# Altium project QUT_Autopilot_Pixracer.PrjPcb (part 1 of 2)
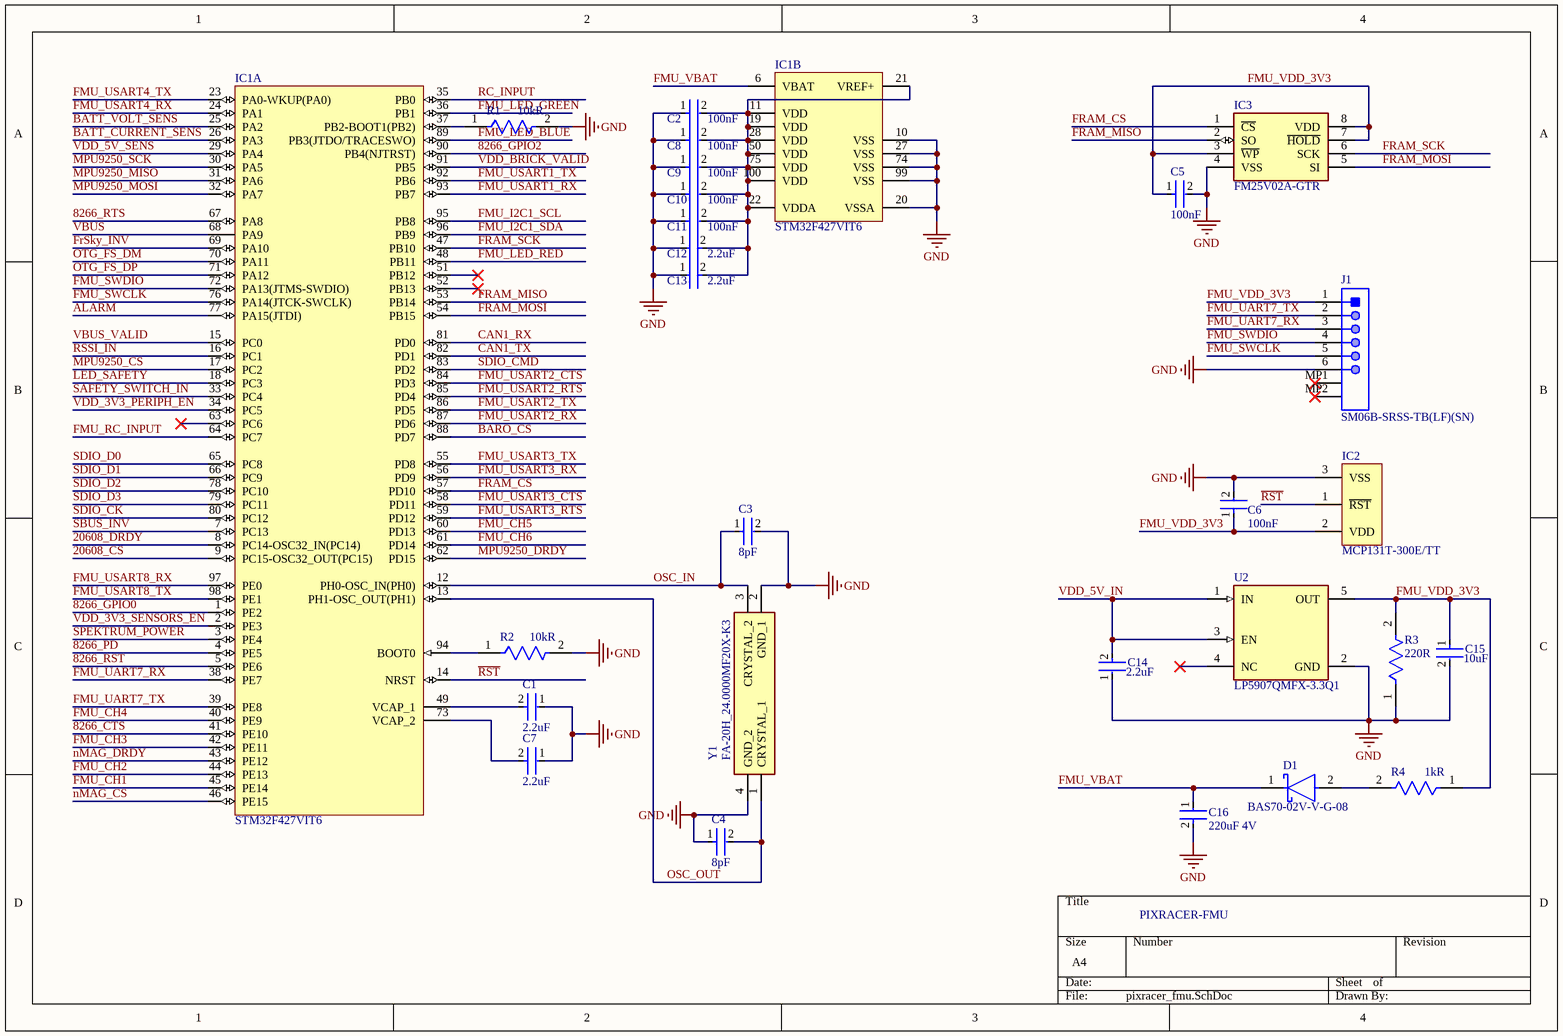
[diagram p0: pixracer_fmu.SchDoc]
5 sheets, 143 parts. Net scope: global (net labels, ports and power ports of the same name join across sheets).
Board file: pixracer_pcb_layout_v1.PcbDoc
Sheets:
  pixracer_fmu.SchDoc
  pixracer_imu.SchDoc
  pixracer_sd_usb_can_i2c.SchDoc
  pixracer_serials.SchDoc
  pixracer_power.SchDoc

## Sheet pixracer_fmu.SchDoc
size A4; SheetNumber: 1; SheetTotal: 5

### Parts
C1  Capacitance: 2.2uF  [FP-C1608-080-0_1-MFG]  (hidden comment: C1608X7R1A225K080AC)
C2  Capacitance: 100nF  [FP-0603-L_1_6_0_15-W_0_81-IPC_B]  (hidden comment: 0603ZC104MAT2A)
C3  Capacitance: 8pF  [FP-CGA3E-0_3-0_1-IPC_A]  (hidden comment: CGA3E2C0G1H080D080AA)
C4  Capacitance: 8pF  [FP-CGA3E-0_3-0_1-IPC_A]  (hidden comment: CGA3E2C0G1H080D080AA)
C5  Capacitance: 100nF  [FP-0603-L_1_6_0_15-W_0_81-IPC_B]  (hidden comment: 0603ZC104MAT2A)
C6  Capacitance: 100nF  [FP-0603-L_1_6_0_15-W_0_81-IPC_B]  (hidden comment: 0603ZC104MAT2A)
C7  Capacitance: 2.2uF  [FP-C1608-080-0_1-MFG]  (hidden comment: C1608X7R1A225K080AC)
C8  Capacitance: 100nF  [FP-0603-L_1_6_0_15-W_0_81-IPC_B]  (hidden comment: 0603ZC104MAT2A)
C9  Capacitance: 100nF  [FP-0603-L_1_6_0_15-W_0_81-IPC_B]  (hidden comment: 0603ZC104MAT2A)
C10  Capacitance: 100nF  [FP-0603-L_1_6_0_15-W_0_81-IPC_B]  (hidden comment: 0603ZC104MAT2A)
C11  Capacitance: 100nF  [FP-0603-L_1_6_0_15-W_0_81-IPC_B]  (hidden comment: 0603ZC104MAT2A)
C12  Capacitance: 2.2uF  [FP-C1608-080-0_1-MFG]  (hidden comment: C1608X7R1A225K080AC)
C13  Capacitance: 2.2uF  [FP-C1608-080-0_1-MFG]  (hidden comment: C1608X7R1A225K080AC)
C14  Capacitance: 2.2uF  [FP-C1608-080-0_1-MFG]  (hidden comment: C1608X7R1A225K080AC)
C15  Capacitance: 10uF  [FP-CL10-IPC_B]  (hidden comment: CL10A106KP8NNND)
C16  Capacitance: 220uF 4V  [FP-GRM31C-0_3-e0_3_0_9-IPC_C]  (hidden comment: GRM31CR60G227ME11L)
D1  BAS70-02V-V-G-08  [FP-S8-V-3880_02-001-MFG]
IC1  STM32F427VIT6  [STM-LQFP100_N]  (parts A,B of 2)
IC2  MCP131T-300E/TT  [SOT-23-TT3_N]
IC3  FM25V02A-GTR  [SOIC127P602X173-8N]
J1  SM06B-SRSS-TB(LF)(SN)  [JST-SM06B-SRSS-TB_V]
R1  Resistance: 10kR  [FP-ERJ3G-IPC_C]  (hidden comment: ERJ-3GEYJ103V)
R2  Resistance: 10kR  [FP-ERJ3G-IPC_C]  (hidden comment: ERJ-3GEYJ103V)
R3  Resistance: 220R  [FP-CRCW0603-e3-MFG]  (hidden comment: CRCW0603220RFKEB)
R4  Resistance: 1kR  [FP-RC1608-IPC_A]  (hidden comment: RC1608J102CS)
U2  LP5907QMFX-3.3Q1  [FP-DBV0005A-MFG]
Y1  FA-20H_24.0000MF20X-K3  [FA20H160000MF12ZAC3]

### Nets
GND: C1.1 C2.1 C3.2 C4.1 C5.2 C6.2 C7.1 C8.1 C9.1 C10.1 C11.1 C12.1 C13.1 C14.1 C15.2 C16.2 IC1.10(VSS) IC1.20(VSSA) IC1.27(VSS) IC1.74(VSS) IC1.99(VSS) IC2.3(VSS) IC3.4(VSS) J1.6 R1.2 R2.2 R3.1 U2.2(GND) Y1.2(GND_1) Y1.4(GND_2)
8266_CTS: IC1.41(PE10)
8266_GPIO0: IC1.1(PE2)
8266_GPIO2: IC1.90(PB4(NJTRST))
8266_PD: IC1.4(PE5)
8266_RST: IC1.5(PE6)
8266_RTS: IC1.67(PA8)
20608_CS: IC1.9(PC15-OSC32_OUT(PC15))
20608_DRDY: IC1.8(PC14-OSC32_IN(PC14))
~{RST}: IC1.14(NRST) IC2.1(~{RST})
ALARM: IC1.77(PA15(JTDI))
BARO_CS: IC1.88(PD7)
BATT_CURRENT_SENS: IC1.26(PA3)
BATT_VOLT_SENS: IC1.25(PA2)
CAN1_RX: IC1.81(PD0)
CAN1_TX: IC1.82(PD1)
FMU_CH1: IC1.45(PE14)
FMU_CH2: IC1.44(PE13)
FMU_CH3: IC1.42(PE11)
FMU_CH4: IC1.40(PE9)
FMU_CH5: IC1.60(PD13)
FMU_CH6: IC1.61(PD14)
FMU_I2C1_SCL: IC1.95(PB8)
FMU_I2C1_SDA: IC1.96(PB9)
FMU_LED_BLUE: IC1.89(PB3(JTDO/TRACESWO))
FMU_LED_GREEN: IC1.36(PB1)
FMU_LED_RED: IC1.48(PB11)
FMU_RC_INPUT: IC1.64(PC7)
FMU_SWCLK: IC1.76(PA14(JTCK-SWCLK)) J1.5
FMU_SWDIO: IC1.72(PA13(JTMS-SWDIO)) J1.4
FMU_UART7_RX: IC1.38(PE7) J1.3
FMU_UART7_TX: IC1.39(PE8) J1.2
FMU_USART1_RX: IC1.93(PB7)
FMU_USART1_TX: IC1.92(PB6)
FMU_USART2_CTS: IC1.84(PD3)
FMU_USART2_RTS: IC1.85(PD4)
FMU_USART2_RX: IC1.87(PD6)
FMU_USART2_TX: IC1.86(PD5)
FMU_USART3_CTS: IC1.58(PD11)
FMU_USART3_RTS: IC1.59(PD12)
FMU_USART3_RX: IC1.56(PD9)
FMU_USART3_TX: IC1.55(PD8)
FMU_USART4_RX: IC1.24(PA1)
FMU_USART4_TX: IC1.23(PA0-WKUP(PA0))
FMU_USART8_RX: IC1.97(PE0)
FMU_USART8_TX: IC1.98(PE1)
FMU_VBAT: C16.1 D1.1(C) IC1.6(VBAT)
FMU_VDD_3V3: C5.1 C6.1 C15.1 IC2.2(VDD) IC3.3(~{WP}) IC3.7(~{HOLD}) IC3.8(VDD) J1.1 R3.2 R4.1 U2.5(OUT)
FRAM_CS: IC1.57(PD10) IC3.1(~{CS})
FRAM_MISO: IC1.53(PB14) IC3.2(SO)
FRAM_MOSI: IC1.54(PB15) IC3.5(SI)
FRAM_SCK: IC1.47(PB10) IC3.6(SCK)
FrSky_INV: IC1.69(PA10)
LED_SAFETY: IC1.18(PC3)
MPU9250_CS: IC1.17(PC2)
MPU9250_DRDY: IC1.62(PD15)
MPU9250_MISO: IC1.31(PA6)
MPU9250_MOSI: IC1.32(PA7)
MPU9250_SCK: IC1.30(PA5)
nMAG_CS: IC1.46(PE15)
nMAG_DRDY: IC1.43(PE12)
OSC_IN: C3.1 IC1.12(PH0-OSC_IN(PH0)) Y1.3(CRYSTAL_2)
OSC_OUT: C4.2 IC1.13(PH1-OSC_OUT(PH1)) Y1.1(CRYSTAL_1)
OTG_FS_DM: IC1.70(PA11)
OTG_FS_DP: IC1.71(PA12)
RC_INPUT: IC1.35(PB0)
RSSI_IN: IC1.16(PC1)
SAFETY_SWITCH_IN: IC1.33(PC4)
SBUS_INV: IC1.7(PC13)
SDIO_CK: IC1.80(PC12)
SDIO_CMD: IC1.83(PD2)
SDIO_D0: IC1.65(PC8)
SDIO_D1: IC1.66(PC9)
SDIO_D2: IC1.78(PC10)
SDIO_D3: IC1.79(PC11)
SPEKTRUM_POWER: IC1.3(PE4)
VBUS: IC1.68(PA9)
VBUS_VALID: IC1.15(PC0)
VDD_3V3_PERIPH_EN: IC1.34(PC5)
VDD_3V3_SENSORS_EN: IC1.2(PE3)
VDD_5V_IN: C14.2 U2.1(IN) U2.3(EN)
VDD_5V_SENS: IC1.29(PA4)
VDD_BRICK_VALID: IC1.91(PB5)
NetC1_2: C1.2 IC1.49(VCAP_1)
NetC2_2: C2.2 C8.2 C9.2 C10.2 C11.2 C12.2 C13.2 IC1.11(VDD) IC1.19(VDD) IC1.21(VREF+) IC1.22(VDDA) IC1.28(VDD) IC1.50(VDD) IC1.75(VDD) IC1.100(VDD)
NetC7_2: C7.2 IC1.73(VCAP_2)
NetD1_2: D1.2(A) R4.2
NetIC1_37: IC1.37(PB2-BOOT1(PB2)) R1.1
NetIC1_94: IC1.94(BOOT0) R2.1

Not connected (* = marked no-connect by the designer): IC1 51(PB12)* 52(PB13)* 63(PC6)*; J1 MP1* MP2*; U2 4(NC)*

### Notes on the sheet
- PIXRACER-FMU

### Library data of the parts
C1 C7 C12-C14 = CMP-08246-006835-1: Multilayer Ceramic Capacitors 2.2μF ±10% 10V X7R SMD 0603; Lead Free: Lead Free; Mount: Surface Mount; Case Code (Metric): 1608; Construction: Flat; Packaging: Tape and Reel; REACH SVHC: No SVHC; Weight: 7.1E-05oz; Resistor Type: Ceramic; Package Quantity: 4000; Voltage Rating (DC): 10V; Case/Package: 0603; Termination: SMD/SMT; Case Code (Imperial): 0603; Series: C; Voltage Rating: 10V; Min Operating Temperature: -55°C; Dielectric Material: Ceramic; Length: 1.6mm; Tolerance: 10%; Depth: 0.8mm; Width: 0.031inch; Dielectric: X7R; Max Operating Temperature: 125°C; RoHS Compliant: Yes; Height: 0.8mm; Thickness: 0.037inch
C2 C5 C6 C8-C11 = CMP-2006-04550-2: General Purpose Ceramic Capacitor, 0603, 100nF, 20%, X7R, 15%, 10V; Mount: Surface Mount; Package Quantity: 4000; RoHS Compliant: Yes; Case Code (Imperial): 0603; Voltage Rating: 10V; Packaging: Tape and Reel; Series: -; Tolerance: 20%; Thickness: 0.035inch; Number of Pins: 2; Min Operating Temperature: -55°C; Case/Package: 0603; Length: 1.6mm; Radiation Hardening: No; Voltage Rating (DC): 10V; Depth: 0.81mm; Lead Pitch: 0.014inch; Termination: SMD/SMT; Case Code (Metric): 1608; Construction: Flat; Width: 0.032inch; Lead Free: Lead Free; Max Operating Temperature: 125°C; Dielectric: X7R
C3 C4 = CMP-08246-000516-1: Cap Ceramic 8pF 50V C0G 0.5pF Pad SMD 0603 +125°C Automotive T/R; Length: 1.6mm; Max Operating Temperature: 125°C; Voltage Rating: 50V; Depth: 0.8mm; Height: 0.8mm; Composition: Ceramic; Package Quantity: 4000; Thickness: 0.035inch; Packaging: Tape and Reel; Weight: 7.1E-05oz; Mount: Surface Mount; Ratings: AEC-Q200; Width: 0.031inch; Voltage Rating (DC): 50V; Termination: SMD/SMT; Case Code (Metric): 1608; Case Code (Imperial): 0603; Min Operating Temperature: -55°C; Dielectric: C0G; Case/Package: 0603; Radiation Hardening: No; REACH SVHC: No SVHC
C15 = CMP-13271-003245-1: Cap Ceramic 10uF 10V X5R ±10% Pad SMD 0603 +85°C T/R; Packaging: Tape and Reel; Dielectric: X5R; Min Operating Temperature: -55°C; Lead Free: Lead Free; Height: 0.8mm; Package Quantity: 10000; Voltage Rating (DC): 10V; Mount: Surface Mount; Tolerance: 10%; Width: 0.031inch; Thickness: 0.035inch; Depth: 0.8mm; Max Operating Temperature: 85°C; Case/Package: 0603; Length: 1.6mm; Voltage Rating: 10V; Radiation Hardening: No
C16 = CMP-06035-014715-1: Chip Multilayer Ceramic Capacitors for General Purpose, 1206, 220uF, X5R, 15%, 20%, 4V; Termination: SMD/SMT; Length: 0.126inch; Weight: 0.001411oz; Lead Free: Lead Free; Packaging: Tape and Reel; Voltage Rating: 4V; Dielectric: X5R; Voltage Rating (DC): 4V; Case Code (Metric): 3216; REACH SVHC: No SVHC; Mount: Surface Mount; Tolerance: 20%; Height: 1.6mm; Case Code (Imperial): 1206; Package Quantity: 2000; Width: 1.6mm; Thickness: 0.075inch; Case/Package: 1206; Max Operating Temperature: 85°C; Min Operating Temperature: -55°C
D1 = CMP-02539-000029-1: DIODE SCHOTTKY 70V 100MA SOD523; Manufacturer: Vishay; Peak Reverse Current: 0.02uA; Max Junction Temp: +125°C; Max Surge Forward Current: 600mA; Value: 1.5pF; Device Class L3: Schottky Diodes; Reverse Voltage: 70V; ComponentLink2URL: https://www.vishay.com/docs/82393/bas7002v.pdf; Device Class L2: Diodes; Max Repetitive Reverse Voltage: 70V; Forward Current: 100mA; Category: Diode; Temperature Range High: +125°C; Lead Free: Yes; ComponentLink2Description: Datasheet; Octopart: https://octopart.com/bas70-02v-v-g-08-vishay-44351226; Package: S8-V-3880.02-001; RoHS: TRUE; Mouser Description: Schottky Diodes & Rectifiers SCHOTTKY DIODE, PLASTIC; Ipc Land Pattern Name: SODFL16080X60; Capacitance: 1.5pF; Temperature: to +125°C; Device Class L1: Discrete Semiconductors; Height: 0.7mm; Manufacturer Part Number: BAS70-02V-V-G-08; Digikey Description: DIODE SCHOTTKY 70V 100MA SOD523; Automotive: No
IC1 = CMP-0243-00027-2: ARM Cortex-M4 32-bit MCU+FPU, 210 DMIPS, 2048 kB Flash, 256 kB Internal RAM, 82 I/Os, 100-pin LQFP, -40 to 85 degC, Tray; Manufacturer: STMicroelectronics; D/A Converter: 2x12-bit; FLASH Size (Prog) (kB): 2048; I/Os (High Current): 82; Internal RAM Size (kB): 256; Supply Voltage(Vcc) min (V): 1.8; Supply Voltage(Vcc) max (V): 3.6; Operating Frequency(F) (Processor speed) (MHz): 168; Core: ARM Cortex-M4; Mounting Technology: Surface Mount; ComponentLink1URL: http://www.st.com/web/en/home.html; ComponentLink3Description: Package Specification; DatasheetVersion: Rev. 1; ComponentLink3URL: http://www.st.com/st-web-ui/static/active/en/resource/technical/document/data_brief/DM00071938.pdf; ComponentLink2Description: Datasheet; PartNumber: STM32F427VIT6; PackageReference: LQFP100; PackageVersion: Rev. 1, 06/2013; ComponentLink1Description: Manufacturer URL; ComponentLink2URL: http://www.st.com/st-web-ui/static/active/en/resource/technical/document/datasheet/DM00071990.pdf; Packing: Tray; PackageDescription: 100-Pin Low Profile Quad Flat Package, 14 x 14 mm Body, 0.5 mm Pitch
IC2 = CMP-0138-00370-1: Micropower Voltage Supervisors, 3-Pin SOT-23, Extended Temperature, Tape and Reel; Code_IPC: SOT23-3; DatasheetVersion: revB, Mar-2005; PackageReference: SOT-23-TT3; PackageVersion: revBB, Aug-2009; PackageDescription: 3-Lead Plastic Small Outline Transistor (TT) [SOT-23]
IC3 = FM25V02A-GTR: Integrated Circuit; Manufacturer_Name: Cypress Semiconductor; Datasheet Link: https://www.cypress.com/file/139666/download; Height: 1.727mm; Manufacturer_Part_Number: FM25V02A-GTR; Mouser Part Number: 727-FM25V02A-GTR; Mouser Price/Stock: https://www.mouser.co.uk/ProductDetail/Cypress-Semiconductor/FM25V02A-GTR?qs=ILgNtqsyH21Sja70fv%2FiBQ%3D%3D; Arrow Part Number: FM25V02A-GTR; Arrow Price/Stock: https://www.arrow.com/en/products/fm25v02a-gtr/cypress-semiconductor?region=nac
J1 = CMP-2000-07080-1: Male Header, Pitch 1 mm, 1 x 6 Position, Height 2.95 mm, -25 to 85 degC, RoHS, Tape and Reel; Manufacturer: JST; No of Positions: 6; Pitch: 1mm; Style/Orientation: RightAngleHeader/Plug; Datasheet URL: https://datasheet.ciiva.com/26894/getdatasheetpartid-708885-26894671.pdf; Package Description: Male Header, Pitch 1 mm, 1 X 6 Position, Height 2.9 mm; Termination: Solder; Manufacturer URL: http://www.jst.com/home2.html; Type: ShroudedHeader; Package Reference: SM06B-SRSS-TB; Datasheet Version: 11/2010; Mounting Technology: SurfaceMount
R1 R2 = CMP-2000-00704-2: RES SMD 10K OHM 5% 1/10W 0603; Temperature Coefficient: 200ppm/°C; Max Power Dissipation: 100mW; Voltage Rating (DC): 50V; Voltage Rating: 75V; Resistor Type: Thick Film; Tolerance: 5%; Military Standard: Not; Package Quantity: 1; Max Operating Temperature: 155°C; Mount: Surface Mount; Technology: THICK FILM; Case/Package: 0603; Construction: Rectangular; Depth: 0.8mm; Case Code (Imperial): 0603; Weight: 7.1E-05oz; Features: Automotive AEC-Q200; Packaging: Tape and Reel; Width: 0.8mm; Length: 1.6mm; Termination: SMD/SMT; Power Rating: 100mW; Lead Free: Lead Free; Number of Terminations: 2; Height: 0.45mm; RoHS Compliant: Yes; Min Operating Temperature: -55°C; Contact Plating: Tin; REACH SVHC: No SVHC; Resistance Tolerance: 5%; Series: ERJ; Working Voltage: 75V; Case Code (Metric): 1608
R3 = CMP-02407-003555-1: RES Thick Film, 220Ω, 1%, 0.1W, 100ppm/°C, 0603; Voltage Rating: 75V; Power Rating: 100mW; Length: 1.55mm; Weight: 7.1E-05oz; Package Quantity: 10000; Case/Package: 0603; Composition: Thick Film; Max Operating Temperature: 155°C; Military Standard: Not; Tolerance: 1%; Lead Free: Lead Free; Number of Terminations: 2; Min Operating Temperature: -55°C; Case Code (Imperial): 0603; Max Power Dissipation: 100mW; Features: Automotive AEC-Q200; Packaging: Tape and Reel; Temperature Coefficient: 100ppm/°C; Case Code (Metric): 1608; Termination: SMD/SMT; Depth: 0.85mm; Height: 0.02inch; Width: 0.85mm
R4 = CMP-13261-002301-1: Res Thick Film 0603 1kΩ 5% 0.1W ±100ppm/°C Molded SMD T/R; Power Rating: 100mW; Voltage Rating (DC): 50V; Contact Plating: Tin; Mount: Surface Mount; Number of Terminations: 2; Features: Moisture Resistant; Max Power Dissipation: 100mW; Military Standard: Not; Case/Package: 0603; Radiation Hardening: No; Temperature Coefficient: 100ppm/°C; Length: 1.6mm; Height: 0.022inch; Case Code (Metric): 1608; Max Operating Temperature: 155°C; Composition: Thick Film; Tolerance: 5%; Width: 0.031inch; Depth: 0.8mm; Packaging: Tape and Reel; Lead Free: Lead Free; Case Code (Imperial): 0603; Min Operating Temperature: -55°C
U2 = CMP-04917-000018-1: IC REG LINEAR 3.3V 250MA SOT23-5; Manufacturer: Texas Instruments; Number Of Outputs: 1; Dropout Voltage: 120mV; Max Junction Temp: +125°C; Output Type: Fixed; Standoff Height: 0mm; Min Supply Voltage: 2.2V; Max Supply Voltage: 5.5V; Nominal Supply Current: 12-250uA; Automotive Grade: Grade 1; Output Voltage: 3.3V; Height: 1.45mm; Category: IC; Output Current: 250mA; Automotive: Yes; Device Class L3: Voltage Regulators - Linear; Temperature Range Low: -40°C; Device Class L1: Integrated Circuits (ICs); Temperature Range High: +125°C; Octopart: https://octopart.com/lp5907qmfx-3.3q1-texas+instruments-50417899; Lead Free: Yes; Device Class L2: Power Management ICs; Manufacturer Part Number: LP5907QMFX-3.3Q1; Mouser Description: Automotive 250-mA ultra-low-noise low-IQ low-dropout (LDO) linear regulator 5-SOT-23 -40 to 125; ComponentLink2Description: Datasheet; Digikey Description: IC REG LINEAR 3.3V 250MA SOT23-5; Temperature: -40°C to +125°C; Package: DBV0005A; ComponentLink2URL: http://www.ti.com/lit/ds/symlink/lp5907-q1.pdf; RoHS: TRUE
Y1 = FA-20H_24.0000MF20X-K3: Crystal or Oscillator; Manufacturer_Name: Epson Timing; Manufacturer_Part_Number: FA-20H 24.0000MF20X-K3; Datasheet Link: https://support.epson.biz/td/api/doc_check.php?dl=brief_FA-20H&lang=en; Height: 0.55mm; Mouser Part Number: 732-FA20H-24F20X-K3; Mouser Price/Stock: https://www.mouser.co.uk/ProductDetail/Epson-Timing/FA-20H-240000MF20X-K3?qs=CANAagUtPAp2w31393daZQ%3D%3D

## Sheet pixracer_imu.SchDoc
size A4; SheetNumber: 2; SheetTotal: 5
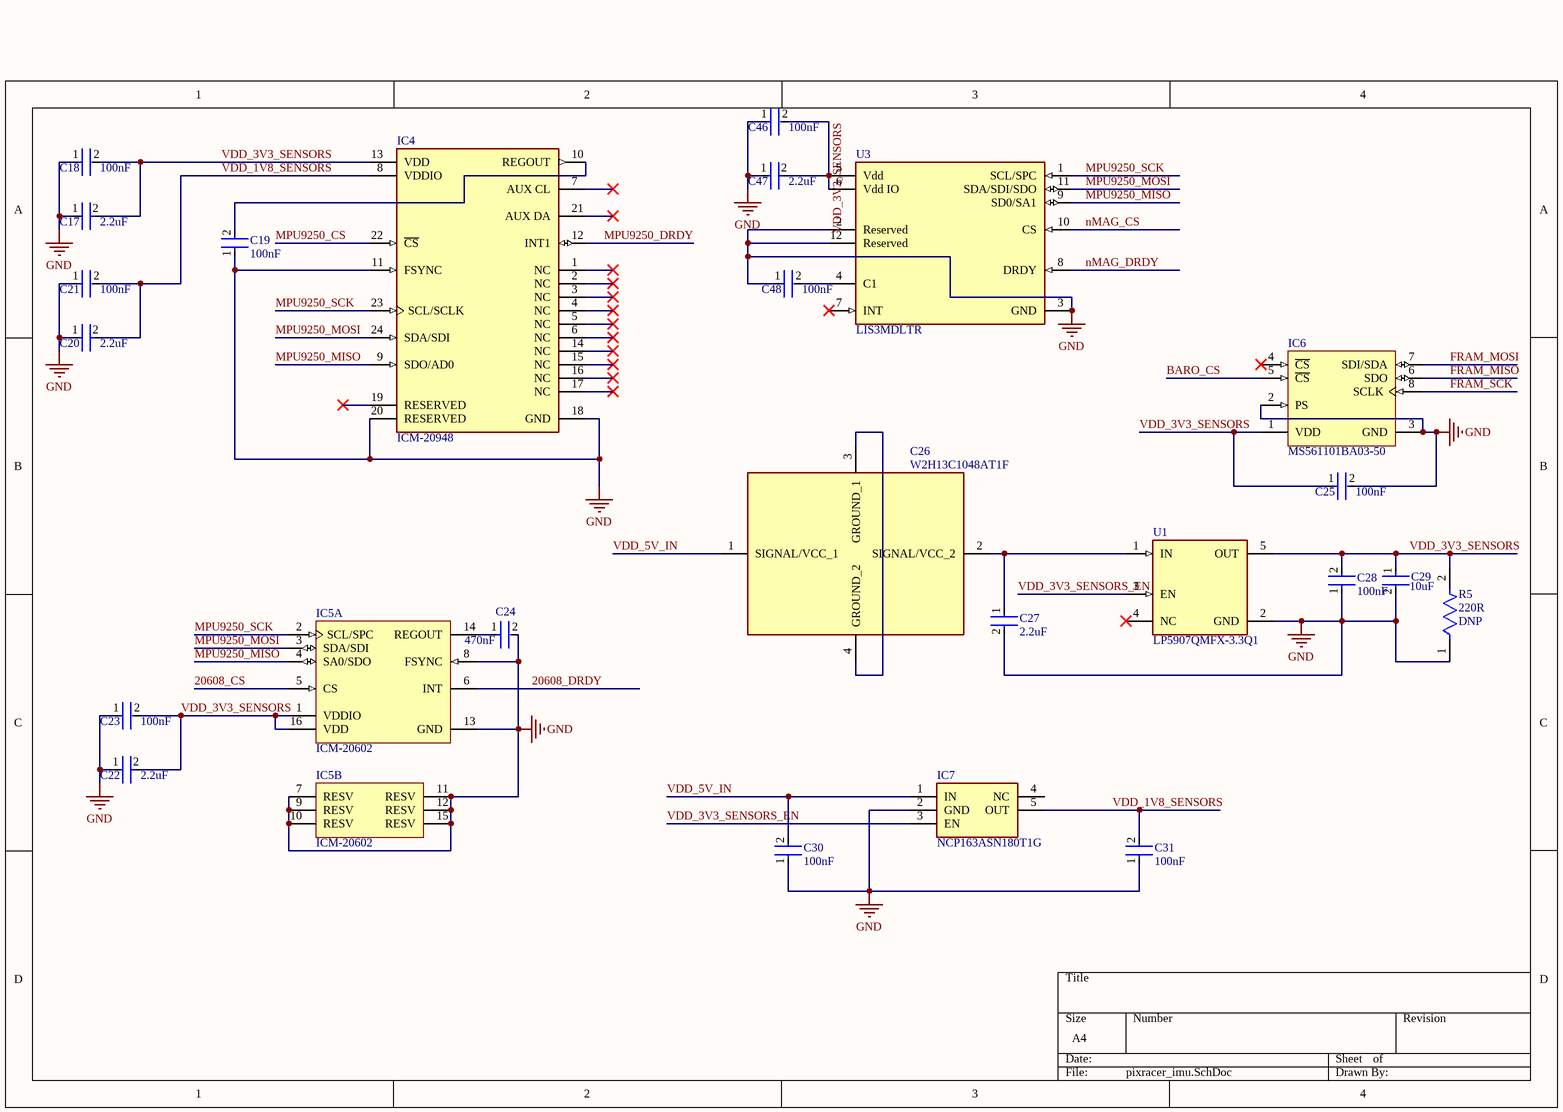
[diagram p1: pixracer_imu.SchDoc]

### Parts
C17  Capacitance: 2.2uF  [FP-C1608-080-0_1-MFG]  (hidden comment: C1608X7R1A225K080AC)
C18  Capacitance: 100nF  [FP-0603-L_1_6_0_15-W_0_81-IPC_B]  (hidden comment: 0603ZC104MAT2A)
C19  Capacitance: 100nF  [FP-0603-L_1_6_0_15-W_0_81-IPC_B]  (hidden comment: 0603ZC104MAT2A)
C20  Capacitance: 2.2uF  [FP-C1608-080-0_1-MFG]  (hidden comment: C1608X7R1A225K080AC)
C21  Capacitance: 100nF  [FP-0603-L_1_6_0_15-W_0_81-IPC_B]  (hidden comment: 0603ZC104MAT2A)
C22  Capacitance: 2.2uF  [FP-C1608-080-0_1-MFG]  (hidden comment: C1608X7R1A225K080AC)
C23  Capacitance: 100nF  [FP-0603-L_1_6_0_15-W_0_81-IPC_B]  (hidden comment: 0603ZC104MAT2A)
C24  Capacitance: 470nF  [FP-CL10-IPC_B]  (hidden comment: CL10B474KP8NNNC)
C25  Capacitance: 100nF  [FP-0603-L_1_6_0_15-W_0_81-IPC_B]  (hidden comment: 0603ZC104MAT2A)
C26  W2H13C1048AT1F  [W2H13C1048AT1A]
C27  Capacitance: 2.2uF  [FP-C1608-080-0_1-MFG]  (hidden comment: C1608X7R1A225K080AC)
C28  Capacitance: 100nF  [FP-0603-L_1_6_0_15-W_0_81-IPC_B]  (hidden comment: 0603ZC104MAT2A)
C29  Capacitance: 10uF  [FP-CL10-IPC_B]  (hidden comment: CL10A106KP8NNND)
C30  Capacitance: 100nF  [FP-0603-L_1_6_0_15-W_0_81-IPC_B]  (hidden comment: 0603ZC104MAT2A)
C31  Capacitance: 100nF  [FP-0603-L_1_6_0_15-W_0_81-IPC_B]  (hidden comment: 0603ZC104MAT2A)
C46  Capacitance: 100nF  [FP-0603-L_1_6_0_15-W_0_81-IPC_B]  (hidden comment: 0603ZC104MAT2A)
C47  Capacitance: 2.2uF  [FP-C1608-080-0_1-MFG]  (hidden comment: C1608X7R1A225K080AC)
C48  Capacitance: 100nF  [FP-0603-L_1_6_0_15-W_0_81-IPC_B]  (hidden comment: 0603ZC104MAT2A)
IC4  ICM-20948  [FP-ICM-20948-IPC_C]
IC5  ICM-20602  [INSE-I62-16]  (parts A,B of 2)
IC6  MS561101BA03-50  [MSI-MS561101BA03-50-8_V]
IC7  NCP163ASN180T1G  [SOT95P280X145-5N]
R5  DNP  Resistance: 220R  [FP-CRCW0603-e3-MFG]
U1  LP5907QMFX-3.3Q1  [FP-DBV0005A-MFG]
U3  LIS3MDLTR  [FP-VFLGA-12-8365767-MFG]

### Nets
GND: C17.1 C18.1 C19.1 C20.1 C21.1 C22.1 C23.1 C24.2 C25.2 C27.2 C28.1 C29.2 C30.1 C31.1 C46.1 C47.1 C48.1 IC4.11(FSYNC) IC4.18(GND) IC4.20(RESERVED) IC5.7(RESV) IC5.8(FSYNC) IC5.9(RESV) IC5.10(RESV) IC5.11(RESV) IC5.12(RESV) IC5.13(GND) IC5.15(RESV) IC6.2(PS) IC6.3(GND) IC7.2(GND) R5.1 U1.2(GND) U3.2(Reserved) U3.3(GND) U3.12(Reserved)
20608_CS: IC5.5(CS)
20608_DRDY: IC5.6(INT)
BARO_CS: IC6.5(~{CS})
FRAM_MISO: IC6.6(SDO)
FRAM_MOSI: IC6.7(SDI/SDA)
FRAM_SCK: IC6.8(SCLK)
MPU9250_CS: IC4.22(~{CS})
MPU9250_DRDY: IC4.12(INT1)
MPU9250_MISO: IC4.9(SDO/AD0) IC5.4(SA0/SDO) U3.9(SD0/SA1)
MPU9250_MOSI: IC4.24(SDA/SDI) IC5.3(SDA/SDI) U3.11(SDA/SDI/SDO)
MPU9250_SCK: IC4.23(SCL/SCLK) IC5.2(SCL/SPC) U3.1(SCL/SPC)
nMAG_CS: U3.10(CS)
nMAG_DRDY: U3.8(DRDY)
VDD_1V8_SENSORS: C20.2 C21.2 C31.2 IC4.8(VDDIO) IC7.5(OUT)
VDD_3V3_SENSORS: C17.2 C18.2 C22.2 C23.2 C25.1 C28.2 C29.1 C46.2 C47.2 IC4.13(VDD) IC5.1(VDDIO) IC5.16(VDD) IC6.1(VDD) R5.2 U1.5(OUT) U3.5(Vdd) U3.6(Vdd_IO)
VDD_3V3_SENSORS_EN: IC7.3(EN) U1.3(EN)
VDD_5V_IN: C26.1(SIGNAL/VCC_1) C30.2 IC7.1(IN)
NetC19_2: C19.2 IC4.10(REGOUT)
NetC24_1: C24.1 IC5.14(REGOUT)
NetC26_2: C26.2(SIGNAL/VCC_2) C27.1 U1.1(IN)
NetC26_3: C26.3(GROUND_1) C26.4(GROUND_2)
NetC48_2: C48.2 U3.4(C1)

Not connected (* = marked no-connect by the designer): IC4 1(NC)* 2(NC)* 3(NC)* 4(NC)* 5(NC)* 6(NC)* 7(AUX_CL)* 14(NC)* 15(NC)* 16(NC)* 17(NC)* 19(RESERVED)* 21(AUX_DA)*; IC6 4(~{CS})*; IC7 4(NC); U1 4(NC)*; U3 7(INT)*

### Library data of the parts
C17 C20 C22 C27 C47 = CMP-08246-006835-1: as C1 on sheet pixracer_fmu; Lead Free: Lead Free; Mount: Surface Mount; Case Code (Metric): 1608; Construction: Flat; Packaging: Tape and Reel; REACH SVHC: No SVHC; Weight: 7.1E-05oz; Resistor Type: Ceramic; Package Quantity: 4000; Voltage Rating (DC): 10V; Case/Package: 0603; Termination: SMD/SMT; Case Code (Imperial): 0603; Series: C; Voltage Rating: 10V; Min Operating Temperature: -55°C; Dielectric Material: Ceramic; Length: 1.6mm; Tolerance: 10%; Depth: 0.8mm; Width: 0.031inch; Dielectric: X7R; Max Operating Temperature: 125°C; RoHS Compliant: Yes; Height: 0.8mm; Thickness: 0.037inch
C18 C19 C21 C23 C25 C28 C30 C31 C46 C48 = CMP-2006-04550-2: as C2 on sheet pixracer_fmu; Mount: Surface Mount; Package Quantity: 4000; RoHS Compliant: Yes; Case Code (Imperial): 0603; Voltage Rating: 10V; Packaging: Tape and Reel; Series: -; Tolerance: 20%; Thickness: 0.035inch; Number of Pins: 2; Min Operating Temperature: -55°C; Case/Package: 0603; Length: 1.6mm; Radiation Hardening: No; Voltage Rating (DC): 10V; Depth: 0.81mm; Lead Pitch: 0.014inch; Termination: SMD/SMT; Case Code (Metric): 1608; Construction: Flat; Width: 0.032inch; Lead Free: Lead Free; Max Operating Temperature: 125°C; Dielectric: X7R
C24 = CMP-13271-000054-1: Cap Ceramic 470nF 10V X7R ±10% Pad SMD 0603 +125°C T/R; Case Code (Imperial): 0603; Mount: Surface Mount; Width: 0.031inch; Voltage Rating: 10V; Package Quantity: 1; Radiation Hardening: No; Thickness: 0.035inch; Case Code (Metric): 1608; Voltage: 10V; Packaging: Tape and Reel; Length: 1.6mm; Dielectric: X7R; Lead Free: Lead Free; Depth: 0.8mm; Max Operating Temperature: 125°C; Tolerance: 10%; Voltage Rating (DC): 10V; Min Operating Temperature: -55°C; Case/Package: 0603; Height: 0.8mm
C26 = W2H13C1048AT1F: Capacitor; Manufacturer_Name: AVX; Datasheet Link: https://componentsearchengine.com/Datasheets/1/W2H13C1048AT1F.pdf; Height: 1mm; Manufacturer_Part_Number: W2H13C1048AT1F; Mouser Part Number: 581-W2H13C1048AT1F; Mouser Price/Stock: https://www.mouser.com/Search/Refine.aspx?Keyword=581-W2H13C1048AT1F; Arrow Part Number: W2H13C1048AT1F; Arrow Price/Stock: https://www.arrow.com/en/products/w2h13c1048at1f/avx
C29 = CMP-13271-003245-1: as C15 on sheet pixracer_fmu; Packaging: Tape and Reel; Dielectric: X5R; Min Operating Temperature: -55°C; Lead Free: Lead Free; Height: 0.8mm; Package Quantity: 10000; Voltage Rating (DC): 10V; Mount: Surface Mount; Tolerance: 10%; Width: 0.031inch; Thickness: 0.035inch; Depth: 0.8mm; Max Operating Temperature: 85°C; Case/Package: 0603; Length: 1.6mm; Voltage Rating: 10V; Radiation Hardening: No
IC4 = CMP-221217-000001-1: IMU ACCEL/GYRO/COMPI2C/SPI 24QFN
IC5 = CMP-2000-07589-1: High Performance 6-Axis MEMS MotionTracking(TM) Device, 1.71 to 3.45 V, -40 to 85 degC, 16-Pin LGA, RoHS; Manufacturer: InvenSense; Sensor Type: Temperature; Output Type: I2C; RoHSCompliant: True; Datasheet Version: Rev. 1.0, 10/2016; Datasheet URL: http://www.invensense.com/wp-content/uploads/2016/10/DS-000176-ICM-20602-v1.0.pdf; Min Operating Temperature: -40degC; Mounting Technology: SurfaceMount; Max Operating Temperature: 85degC; Manufacturer URL: http://www.invensense.com/; Package Reference: I62-16; Package Description: 16-Pin Land Grid Array, Body 3 x 3 mm, Pitch 0.5 mm
IC6 = CMP-2000-05251-1: Barometric Pressure Sensor, with Stainless Steel Cap, 1.8 to 3.6 V, -45 to 85 degC, 8-Pin QFN, RoHS, Tape and Reel; Manufacturer: Measurement Specialties; Operating Pressure Max: 1200mbar; Supply Current: 12.5µA; Supply Voltage Max: 3.6V; Supply Voltage Min: 1.8V; No. of Pins: 8; Connection Size: 0.5mm; SVHC: NoSVHC(20-Jun-2013); Operating Pressure Min: 10mbar; Manufacturer URL: http://www.meas-spec.com/; Operating Temperature Min: -40degC; Pressure Type: Barometric; Package Reference: MS561101BA03-50-8; Datasheet URL: http://www.te.com/commerce/DocumentDelivery/DDEController?Action=srchrtrv&DocNm=MS5611-01BA03&DocType=Data+Sheet&DocLang=English&DocFormat=pdf&PartCntxt=CAT-BLPS0036; Package Description: 8-Pin Surface Mount Device, Body 5 x 3 mm, Pitch 1.25 mm; Sensor Case Style: QFN; Datasheet Version: Sep-15; Operating Temperature Max: 85degC
IC7 = NCP163ASN180T1G: Integrated Circuit; Manufacturer_Name: onsemi; Datasheet Link: https://componentsearchengine.com/Datasheets/1/NCP163ASN180T1G.pdf; Height: 1.45mm; Manufacturer_Part_Number: NCP163ASN180T1G; Mouser Part Number: 863-NCP163ASN180T1G; Mouser Price/Stock: https://www.mouser.co.uk/ProductDetail/onsemi/NCP163ASN180T1G?qs=vLWxofP3U2z0o2tJM%252BNAYw%3D%3D; Arrow Part Number: NCP163ASN180T1G; Arrow Price/Stock: https://www.arrow.com/en/products/ncp163asn180t1g/on-semiconductor
R5 = CMP-02407-003555-1: as R3 on sheet pixracer_fmu; Length: 1.55mm; Weight: 7.1E-05oz; Package Quantity: 10000; Case/Package: 0603; Composition: Thick Film; Max Operating Temperature: 155°C; Military Standard: Not; Tolerance: 1%; Lead Free: Lead Free; Number of Terminations: 2; Min Operating Temperature: -55°C; Case Code (Imperial): 0603; Max Power Dissipation: 100mW; Features: Automotive AEC-Q200; Packaging: Tape and Reel; Temperature Coefficient: 100ppm/°C; Case Code (Metric): 1608; Termination: SMD/SMT; Depth: 0.85mm; Height: 0.02inch; Width: 0.85mm
U1 = CMP-04917-000018-1: as U2 on sheet pixracer_fmu; Output Voltage: 3.3V; Height: 1.45mm; Category: IC; Output Current: 250mA; Automotive: Yes; Device Class L3: Voltage Regulators - Linear; Temperature Range Low: -40°C; Device Class L1: Integrated Circuits (ICs); Temperature Range High: +125°C; Octopart: https://octopart.com/lp5907qmfx-3.3q1-texas+instruments-50417899; Lead Free: Yes; Device Class L2: Power Management ICs; Manufacturer Part Number: LP5907QMFX-3.3Q1; Mouser Description: Automotive 250-mA ultra-low-noise low-IQ low-dropout (LDO) linear regulator 5-SOT-23 -40 to 125; ComponentLink2Description: Datasheet; Digikey Description: IC REG LINEAR 3.3V 250MA SOT23-5; Temperature: -40°C to +125°C; Package: DBV0005A; ComponentLink2URL: http://www.ti.com/lit/ds/symlink/lp5907-q1.pdf; RoHS: TRUE
U3 = CMP-2000-07463-2: SENSOR MR I2C/SPI 12LGA; Manufacturer: STMicroelectronics; Sensor Output: I2C,SPI; Operating Supply Current: 40-270uA; Max Supply Voltage: 3.6V; Sensing Method: Magnetic; Min Supply Voltage: 1.71V; ComponentLink2URL: https://www.st.com/resource/en/datasheet/lis3mdl.pdf; Category: IC; Manufacturer Part Number: LIS3MDLTR; Octopart: https://octopart.com/lis3mdltr-stmicroelectronics-29403125; Automotive: No; ComponentLink2Description: Datasheet; RoHS: TRUE; Device Class L3: unset; Device Class L1: Sensors; Temperature: -40°C to +85°C; Height: 1mm; Mouser Description: Board Mount Hall Effect / Magnetic Sensors Ultra Lo-Pwr Hi Perf 3-Axis 1.9-3.6V; Temperature Range High: +85°C; Lead Free: Yes; Device Class L2: Magnetic Sensors; Footprint Url: https://www.st.com/content/ccc/resource/technical/document/technical_note/73/17/9c/16/dd/96/4a/01/CD00134799.pdf/files/CD00134799.pdf/jcr:content/translations/en.CD00134799.pdf; Temperature Range Low: -40°C; Package: VFLGA-12-8365767; Digikey Description: SENSOR MR I2C/SPI 12LGA

## Sheet pixracer_sd_usb_can_i2c.SchDoc
size A4; SheetNumber: 3; SheetTotal: 5
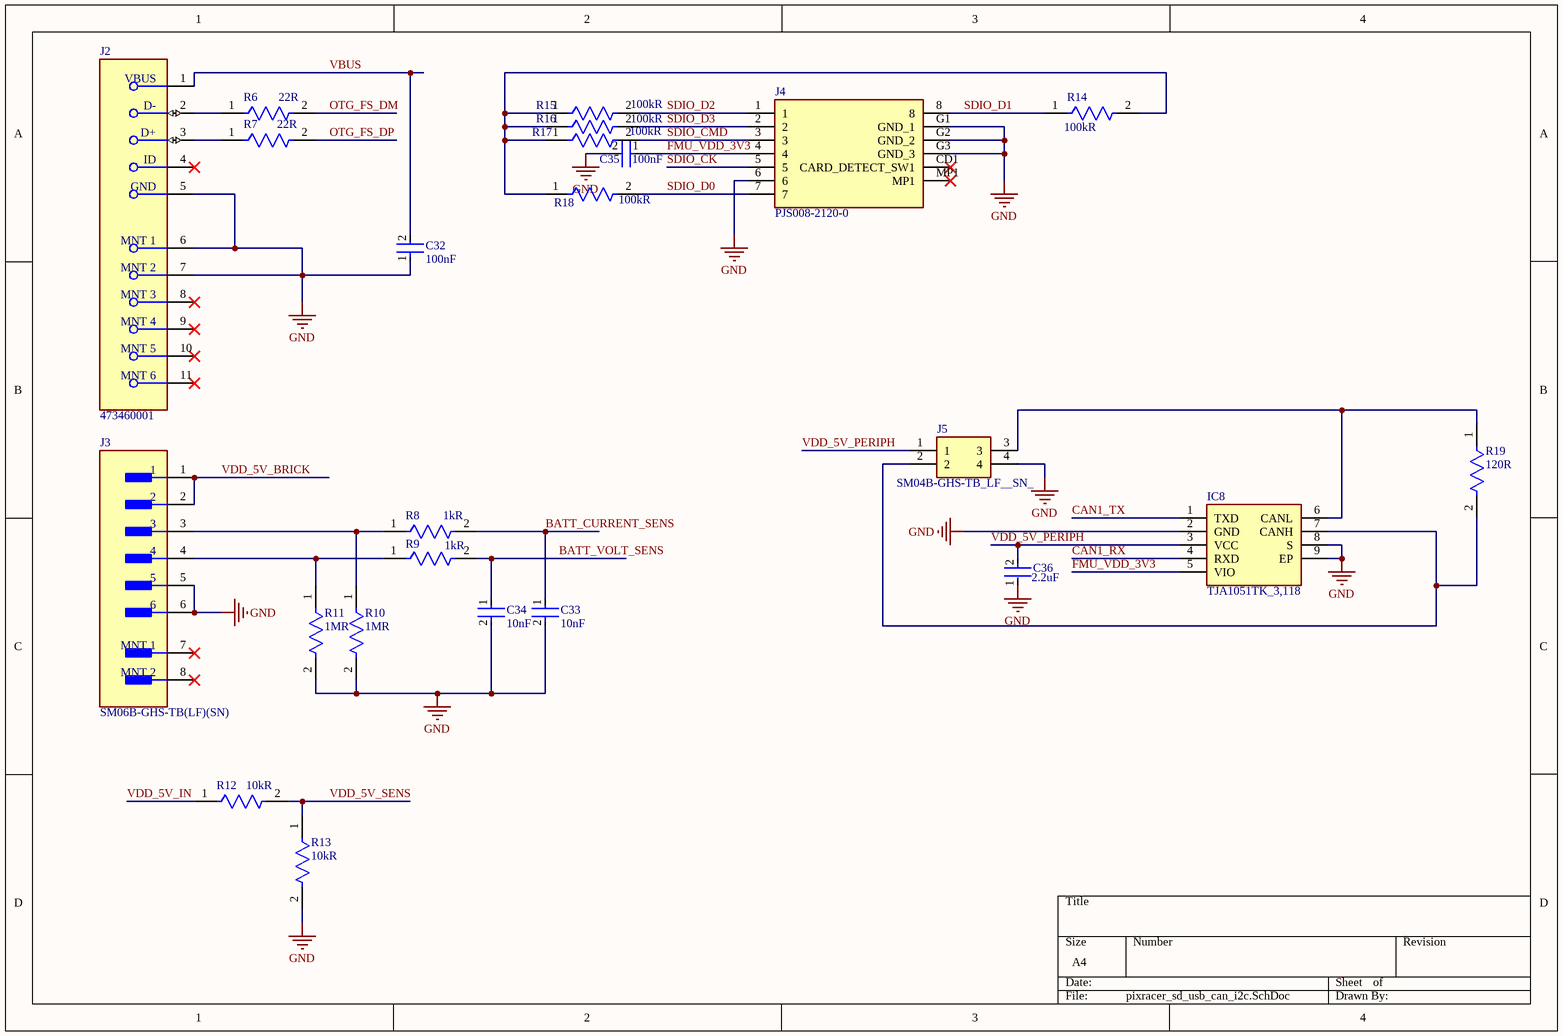
[diagram p2: pixracer_sd_usb_can_i2c.SchDoc]

### Parts
C32  Capacitance: 100nF  [FP-0603-L_1_6_0_15-W_0_81-IPC_B]  (hidden comment: 0603ZC104MAT2A)
C33  Capacitance: 10nF  [FP-C1608-080-0_1-MFG]  (hidden comment: C1608X5R1H103K080AA)
C34  Capacitance: 10nF  [FP-C1608-080-0_1-MFG]  (hidden comment: C1608X5R1H103K080AA)
C35  Capacitance: 100nF  [FP-0603-L_1_6_0_15-W_0_81-IPC_B]  (hidden comment: 0603ZC104MAT2A)
C36  Capacitance: 2.2uF  [FP-C1608-080-0_1-MFG]  (hidden comment: C1608X7R1A225K080AC)
IC8  TJA1051TK_3,118  [SON65P300X300X100-9N-D]
J2  473460001  [FP-473460001-MFG]
J3  SM06B-GHS-TB(LF)(SN)  [FP-SM06B-GHS-TB_LF_SN-MFG]
J4  PJS008-2120-0  [PJS00821200]
J5  SM04B-GHS-TB_LF__SN_  [SM04B-GHS-TB]
R6  Resistance: 22R  [FP-CRCW0603-HPe3-IPC_A]  (hidden comment: CRCW060322R0JNEAHP)
R7  Resistance: 22R  [FP-CRCW0603-HPe3-IPC_A]  (hidden comment: CRCW060322R0JNEAHP)
R8  Resistance: 1kR  [FP-RC1608-IPC_A]  (hidden comment: RC1608J102CS)
R9  Resistance: 1kR  [FP-RC1608-IPC_A]  (hidden comment: RC1608J102CS)
R10  Resistance: 1MR  [FP-CRCW0603-HPe3-IPC_A]  (hidden comment: CRCW06031M00JNEAHP)
R11  Resistance: 1MR  [FP-CRCW0603-HPe3-IPC_A]  (hidden comment: CRCW06031M00JNEAHP)
R12  Resistance: 10kR  [FP-ERJ3G-IPC_C]  (hidden comment: ERJ-3GEYJ103V)
R13  Resistance: 10kR  [FP-ERJ3G-IPC_C]  (hidden comment: ERJ-3GEYJ103V)
R14  Resistance: 100kR  [FP-RMCF0603-IPC_C]  (hidden comment: RMCF0603JT100K)
R15  Resistance: 100kR  [FP-RMCF0603-IPC_C]  (hidden comment: RMCF0603JT100K)
R16  Resistance: 100kR  [FP-RMCF0603-IPC_C]  (hidden comment: RMCF0603JT100K)
R17  Resistance: 100kR  [FP-RMCF0603-IPC_C]  (hidden comment: RMCF0603JT100K)
R18  Resistance: 100kR  [FP-RMCF0603-IPC_C]  (hidden comment: RMCF0603JT100K)
R19  Resistance: 120R  [FP-MCT0603-MFG]  (hidden comment: MCT06030D1200BP100)

### Nets
GND: C32.1 C33.2 C34.2 C35.2 C36.1 IC8.2(GND) IC8.8(S) IC8.9(EP) J2.5(GND) J2.6(MNT_1) J2.7(MNT_2) J3.5 J3.6 J4.6 J4.G1(GND_1) J4.G2(GND_2) J4.G3(GND_3) J5.4 R10.2 R11.2 R13.2
BATT_CURRENT_SENS: C33.1 R8.2
BATT_VOLT_SENS: C34.1 R9.2
CAN1_RX: IC8.4(RXD)
CAN1_TX: IC8.1(TXD)
FMU_VDD_3V3: C35.1 IC8.5(VIO) J4.4
OTG_FS_DM: R6.2
OTG_FS_DP: R7.2
SDIO_CK: J4.5
SDIO_CMD: J4.3 R17.2
SDIO_D0: J4.7 R18.2
SDIO_D1: J4.8 R14.1
SDIO_D2: J4.1 R15.2
SDIO_D3: J4.2 R16.2
VBUS: C32.2 J2.1(VBUS)
VDD_5V_BRICK: J3.1 J3.2
VDD_5V_IN: R12.1
VDD_5V_PERIPH: C36.2 IC8.3(VCC) J5.1
VDD_5V_SENS: R12.2 R13.1
NetIC8_6: IC8.6(CANL) J5.3 R19.1
NetIC8_7: IC8.7(CANH) J5.2 R19.2
NetJ2_2: J2.2(D-) R6.1
NetJ2_3: J2.3(D+) R7.1
NetJ3_3: J3.3 R8.1 R10.1
NetJ3_4: J3.4 R9.1 R11.1
NetR14_2: R14.2 R15.1 R16.1 R17.1 R18.1

Not connected (* = marked no-connect by the designer): J2 4(ID)* 8(MNT_3)* 9(MNT_4)* 10(MNT_5)* 11(MNT_6)*; J3 7(MNT_1)* 8(MNT_2)*; J4 CD1(CARD_DETECT_SW1)* MP1*

### Library data of the parts
C32 C35 = CMP-2006-04550-2: as C2 on sheet pixracer_fmu; Mount: Surface Mount; Package Quantity: 4000; RoHS Compliant: Yes; Case Code (Imperial): 0603; Voltage Rating: 10V; Packaging: Tape and Reel; Series: -; Tolerance: 20%; Thickness: 0.035inch; Number of Pins: 2; Min Operating Temperature: -55°C; Case/Package: 0603; Length: 1.6mm; Radiation Hardening: No; Voltage Rating (DC): 10V; Depth: 0.81mm; Lead Pitch: 0.014inch; Termination: SMD/SMT; Case Code (Metric): 1608; Construction: Flat; Width: 0.032inch; Lead Free: Lead Free; Max Operating Temperature: 125°C; Dielectric: X7R
C33 C34 = CMP-08246-005900-1: Multilayer Ceramic Capacitors 10nF ±10% 50V X5R SMD 0603; Package Quantity: 4000; Thickness: 0.035inch; Tolerance: 10%; Min Operating Temperature: -55°C; Max Operating Temperature: 85°C; Length: 0.063inch; Dielectric Material: Ceramic; Width: 0.031inch; Series: C; Case Code (Metric): 1608; Case Code (Imperial): 0603; RoHS Compliant: Yes; Lead Free: Lead Free; Voltage Rating (DC): 50V; Mount: Surface Mount; Case/Package: 0603; Voltage Rating: 50V; Packaging: Tape and Reel
C36 = CMP-08246-006835-1: as C1 on sheet pixracer_fmu; Lead Free: Lead Free; Mount: Surface Mount; Case Code (Metric): 1608; Construction: Flat; Packaging: Tape and Reel; REACH SVHC: No SVHC; Weight: 7.1E-05oz; Resistor Type: Ceramic; Package Quantity: 4000; Voltage Rating (DC): 10V; Case/Package: 0603; Termination: SMD/SMT; Case Code (Imperial): 0603; Series: C; Voltage Rating: 10V; Min Operating Temperature: -55°C; Dielectric Material: Ceramic; Length: 1.6mm; Tolerance: 10%; Depth: 0.8mm; Width: 0.031inch; Dielectric: X7R; Max Operating Temperature: 125°C; RoHS Compliant: Yes; Height: 0.8mm; Thickness: 0.037inch
IC8 = TJA1051TK_3,118: Integrated Circuit; Manufacturer_Name: NXP; Manufacturer_Part_Number: TJA1051TK/3,118; Datasheet Link: http://www.nxp.com/docs/en/data-sheet/TJA1051.pdf; Height: 1mm; Mouser Part Number: 771-TJA1051TK/3118; Mouser Price/Stock: https://www.mouser.co.uk/ProductDetail/NXP-Semiconductors/TJA1051TK-3118?qs=fhAOlxDPaYVrDQ2e4g%252BBJA%3D%3D; Arrow Part Number: TJA1051TK/3,118; Arrow Price/Stock: https://www.arrow.com/en/products/tja1051tk3118/nxp-semiconductors?region=nac
J2 = CMP-2000-05246-2: CONN RCPT USB2.0 MICRO B SMD R/A; Manufacturer: Molex; Conn Orientation: Right Angle; Is Female: yes; Shielding: true; Pitch: 0.65mm; Number Of Contacts: 5; Voltage Rating: 30V; Current Rating: 1.8A; Device Class L2: USB Connectors; Digikey Description: CONN RCPT USB2.0 MICRO B SMD R/A; Height: 2.945mm; RoHS: TRUE; ComponentLink2Description: Datasheet; Octopart: https://octopart.com/47346-0001-molex-7164928; Automotive: No; Package: 0; Category: Conn; Device Class L1: Connectors; Usb Standard: USB 2.0; Temperature: -30°C to +85°C; Temperature Range Low: -30°C; Footprint Url: https://www.molex.com/pdm_docs/sd/473460001_sd.pdf; ComponentLink2URL: https://www.molex.com/webdocs/datasheets/pdf/en-us/0473460001_IO_CONNECTORS.pdf; Lead Free: Yes; Manufacturer Part Number: 473460001; Contact Material: Gold,Nickel; Temperature Range High: +85°C; Device Class L3: unset
J3 = CMP-17439-000061-1: CONN HEADER SMD R/A 6POS 1.25MM; Number of Contacts: 6; Voltage Rating: 50V; Current Rating: 1A; Connector Type: Outer Shroud Contact; Contact Resistance: 50mR; Orientation: Right Angle; Max Operating Temperature: 85°C; Mount: Surface Mount; Packaging: Tape and Reel; Contact Plating: Tin; Depth: 4.05mm; Max Voltage Rating (AC): 50V; Lead Free: Lead Free; Pitch: 1.25mm; Number of Positions: 6; Max Current Rating: 1A; Termination: Solder; Min Operating Temperature: -25°C; Housing Color: Beige; Fastening Type: Ramp; Length: 10.75mm; Color: Natural; Contact Material: Bronze; Housing Material: Polyamide; Number of Rows: 1
J4 = PJS008-2120-0: Connector; Manufacturer_Name: Yamaichi; Datasheet Link: https://componentsearchengine.com/Datasheets/1/PJS008-2120-0.pdf; Height: 1.5mm; Manufacturer_Part_Number: PJS008-2120-0; Mouser Part Number: 945-PJS008-2120-0; Mouser Price/Stock: https://www.mouser.co.uk/ProductDetail/Yamaichi-Electronics/PJS008-2120-0?qs=pDnM3xHIg41mTHT1wk7bvQ%3D%3D
J5 = SM04B-GHS-TB_LF__SN_: Connector; Manufacturer_Name: JST (JAPAN SOLDERLESS TERMINALS); Manufacturer_Part_Number: SM04B-GHS-TB(LF)(SN); Datasheet Link: http://uk.rs-online.com/web/p/products/7521797
R6 R7 = CMP-02407-008302-1: RES Thick Film, 22Ω, 5%, 0.33W, 200ppm/°C, 0603; Voltage Rating: 75V; Power Rating: 250mW; Min Operating Temperature: -55°C; Weight: 7.1E-05oz; Max Operating Temperature: 155°C; Contact Plating: Tin; Tolerance: 5%; Package Quantity: 5000; Length: 1.6mm; Case Code (Imperial): 0603; Radiation Hardening: No; Lead Free: Lead Free; Case/Package: 0603; Mount: Surface Mount; Depth: 0.85mm; Height: 0.45mm; Military Standard: Not; Temperature Coefficient: 200ppm/°C; Packaging: Tape and Reel; Case Code (Metric): 1608; Composition: Thick Film; Width: 0.8mm
R8 R9 = CMP-13261-002301-1: as R4 on sheet pixracer_fmu; Contact Plating: Tin; Mount: Surface Mount; Number of Terminations: 2; Features: Moisture Resistant; Max Power Dissipation: 100mW; Military Standard: Not; Case/Package: 0603; Radiation Hardening: No; Temperature Coefficient: 100ppm/°C; Length: 1.6mm; Height: 0.022inch; Case Code (Metric): 1608; Max Operating Temperature: 155°C; Composition: Thick Film; Tolerance: 5%; Width: 0.031inch; Depth: 0.8mm; Packaging: Tape and Reel; Lead Free: Lead Free; Case Code (Imperial): 0603; Min Operating Temperature: -55°C
R10 R11 = CMP-02407-009732-1: RES Thick Film, 1MΩ, 5%, 0.33W, 200ppm/°C, 0603; Max Power Dissipation: 250mW; Voltage Rating: 75V; Case Code (Imperial): 0603; Radiation Hardening: No; Length: 0.063inch; Tolerance: 5%; Features: Automotive AEC-Q200; Number of Terminations: 2; Height: 0.022inch; Max Operating Temperature: 155°C; Lead Free: Lead Free; Packaging: Tape and Reel; Case/Package: 0603; Weight: 7.1E-05oz; Width: 0.8mm; Min Operating Temperature: -55°C; Termination: SMD/SMT; Package Quantity: 1; Case Code (Metric): 1608; Composition: Thick Film; Temperature Coefficient: 200ppm/°C; Power Rating: 250mW; Contact Plating: Tin
R12 R13 = CMP-2000-00704-2: as R1 on sheet pixracer_fmu; Resistor Type: Thick Film; Tolerance: 5%; Military Standard: Not; Package Quantity: 1; Max Operating Temperature: 155°C; Mount: Surface Mount; Technology: THICK FILM; Case/Package: 0603; Construction: Rectangular; Depth: 0.8mm; Case Code (Imperial): 0603; Weight: 7.1E-05oz; Features: Automotive AEC-Q200; Packaging: Tape and Reel; Width: 0.8mm; Length: 1.6mm; Termination: SMD/SMT; Power Rating: 100mW; Lead Free: Lead Free; Number of Terminations: 2; Height: 0.45mm; RoHS Compliant: Yes; Min Operating Temperature: -55°C; Contact Plating: Tin; REACH SVHC: No SVHC; Resistance Tolerance: 5%; Series: ERJ; Working Voltage: 75V; Case Code (Metric): 1608
R14-R18 = CMP-26527-000115-1: 100kΩ ±5% 0.1W 0603 Thick Film Chip Resistor AEC-Q200 compliant; Max Power Dissipation: 100mW; Temperature Coefficient: 100ppm/°C; Resistor Type: Thick Film; Height: 0.022inch; Features: Automotive AEC-Q200; Contact Plating: Tin; Lead Free: Lead Free; Number of Terminations: 2; Radiation Hardening: No; Military Standard: Not; Power Rating: 100mW; Mount: Surface Mount; Case Code (Imperial): 0603; Case Code (Metric): 1608; Depth: 0.8mm; Construction: Rectangular; Width: 0.031inch; RoHS Compliant: Yes; Length: 1.55mm; Max Operating Temperature: 155°C; Min Operating Temperature: -55°C; Case/Package: 0603; Tolerance: 5%; Series: RMCF; Packaging: Tape and Reel
R19 = CMP-02407-011907-1: RES SMD 100 OHM 1% 1/8W 0603; Temperature Coefficient: 25ppm/°C; Power Rating: 100mW; Tolerance: 0.1%; Military Standard: Not; RoHS Compliant: Yes; Packaging: Tape and Reel; Contact Plating: Tin; Min Operating Temperature: -55°C; Lead Free: Lead Free; Height: 0.45mm; Depth: 0.85mm; Width: 850um; Mount: Surface Mount; Number of Terminations: 2; Size Code: 0603; Max Power Dissipation: 100mW; Case/Package: 0603; Radiation Hardening: No; Technology: THIN FILM; Construction: Rectangular; Max Operating Temperature: 125°C; Resistor Type: Thin Film; Length: 1.55mm; Features: Anti-Sulfur; Series: MCT - Precision